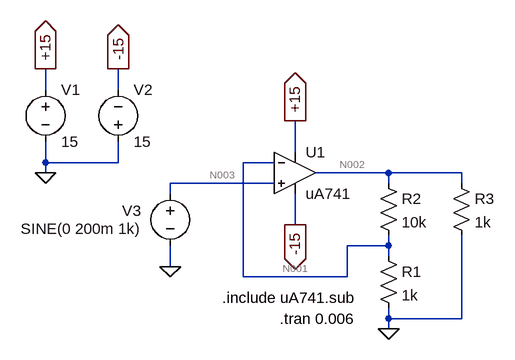
[diagram p0: schematic task.asc]
task.asc, the LTspice schematic file:
Version 4
SHEET 1 880 1000
WIRE -512 -32 -512 -64
WIRE -400 -32 -400 -64
WIRE -128 64 -128 16
WIRE -512 80 -512 48
WIRE -400 80 -400 48
WIRE -400 80 -512 80
WIRE -160 80 -208 80
WIRE -512 96 -512 80
WIRE 16 96 -96 96
WIRE 128 96 16 96
WIRE -160 112 -320 112
WIRE 16 112 16 96
WIRE 128 112 128 96
WIRE -320 128 -320 112
WIRE -128 176 -128 128
WIRE 16 208 16 192
WIRE 16 208 -48 208
WIRE 16 224 16 208
WIRE -320 240 -320 208
WIRE -208 256 -208 80
WIRE -48 256 -48 208
WIRE -48 256 -208 256
WIRE 16 320 16 304
WIRE 128 320 128 192
WIRE 128 320 16 320
WIRE 16 336 16 320
FLAG -512 96 0
FLAG -512 -64 +15
IOPIN -512 -64 Out
FLAG -400 -64 -15
IOPIN -400 -64 Out
FLAG -128 16 +15
IOPIN -128 16 Out
FLAG -128 176 -15
IOPIN -128 176 Out
FLAG 16 336 0
FLAG -320 240 0
SYMBOL OpAmps\\opamp2 -128 32 R0
SYMATTR InstName U1
SYMATTR Value uA741
SYMBOL res 0 96 R0
SYMATTR InstName R2
SYMATTR Value 10k
SYMBOL res 112 96 R0
SYMATTR InstName R3
SYMATTR Value 1k
SYMBOL voltage -512 -48 R0
WINDOW 123 0 0 Left 0
WINDOW 39 0 0 Left 0
SYMATTR InstName V1
SYMATTR Value 15
SYMBOL voltage -400 64 M180
WINDOW 0 24 96 Left 2
WINDOW 3 24 16 Left 2
WINDOW 123 0 0 Left 0
WINDOW 39 0 0 Left 0
SYMATTR InstName V2
SYMATTR Value 15
SYMBOL res 0 208 R0
SYMATTR InstName R1
SYMATTR Value 1k
SYMBOL voltage -320 112 R0
WINDOW 0 -74 42 Left 2
WINDOW 3 -230 70 Left 2
WINDOW 123 0 0 Left 0
WINDOW 39 0 0 Left 0
SYMATTR InstName V3
SYMATTR Value SINE(0 200m 1k)
TEXT -240 288 Left 2 !.include uA741.sub
TEXT -152 320 Left 2 !.tran 0.006

The netlist it stands for:
* task.asc
XU1 N003 N001 +15 -15 N002 uA741  ; pins In+ In- V+ V- OUT
R2 N002 N001 10k
R3 N002 0 1k
V1 +15 0 15
V2 0 -15 15
R1 N001 0 1k
V3 N003 0 SINE(0 200m 1k)
.include uA741.sub
.tran 0.006
.backanno
.end

* Results of the author's LTspice run, read from the files saved beside the schematic
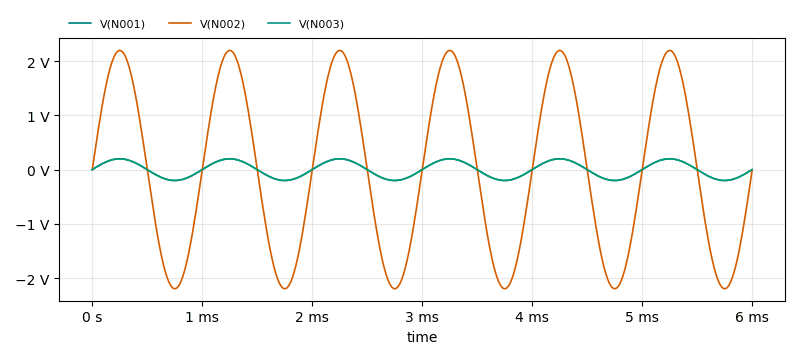
[diagram p1: Transient Analysis of task.asc, plotted from the saved traces]
* Transient Analysis, 1 run:
*   V(N001): min -199.9 mV, max 199.9 mV, average 19.84 µV, rms 141.4 mV, last -2.305 mV
*   V(N002): min -2.198 V, max 2.2 V, average 1.016 mV, rms 1.555 V, last -24.58 mV
*   V(N003): min -199.9 mV, max 200 mV, average -154.8 nV, rms 141.4 mV, last 0 V